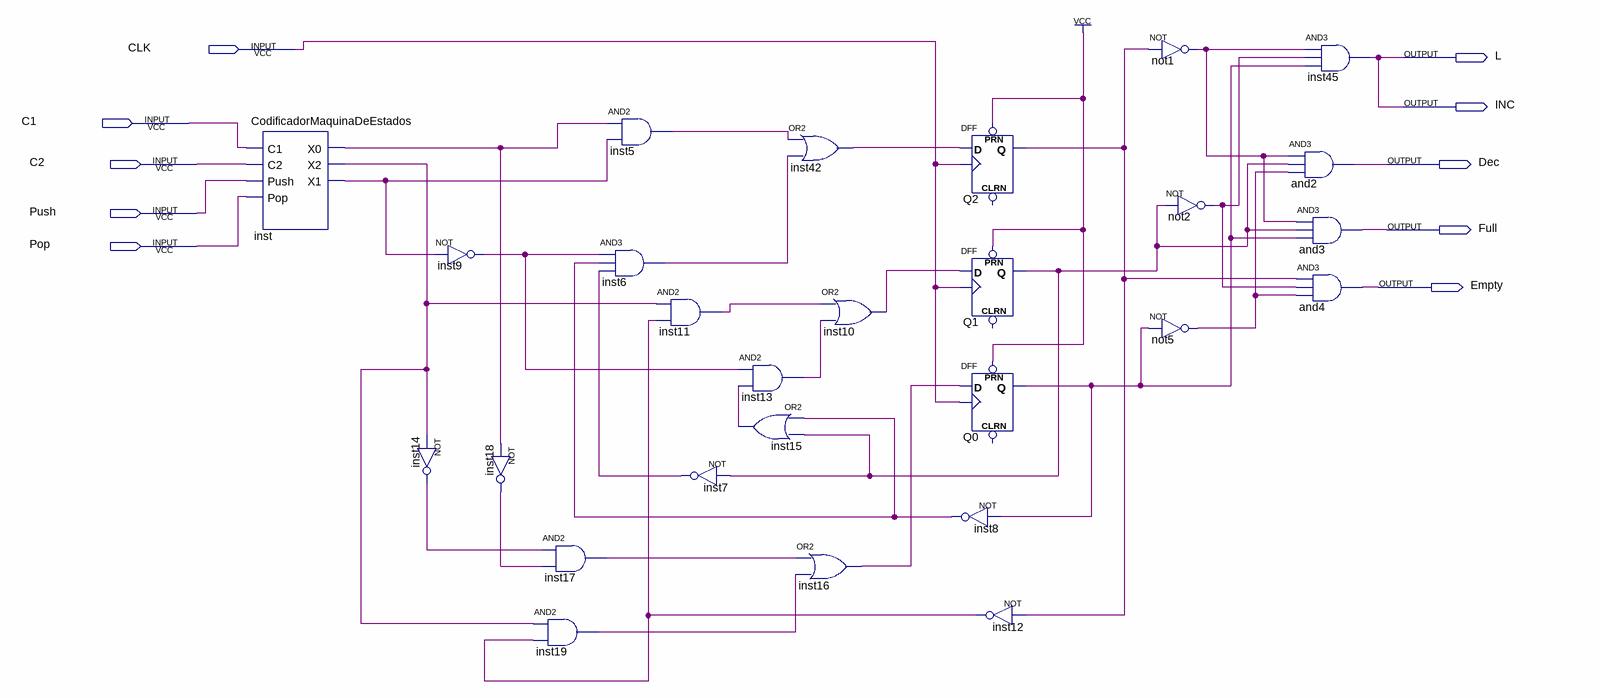
[diagram p0: schematic sheet]
// Quartus schematic MaquinaDestadosV1.bdf as structural Verilog: 27 symbols, 10 pins
module MaquinaDestadosV1 (
  input  CLK,
  input  C1,
  input  C2,
  input  Push,
  input  Pop,
  output L,
  output INC,
  output Dec,
  output Full,
  output Empty
);

  wire inst5_out, inst6_out, inst7_out, inst8_out, inst9_out, inst10_out, inst11_out, inst12_out, inst13_out,
       inst14_out, inst15_out, inst16_out, inst17_out, inst18_out, inst19_out, inst42_out, inst_x0, inst_x1,
       inst_x2, not1_out, not2_out, not5_out, Q0_q, Q1_q, Q2_q;

  CodificadorMaquinaDeEstados inst (.C1(C1), .C2(C2), .Push(Push), .Pop(Pop), .X0(inst_x0), .X2(inst_x2), .X1(inst_x1));
  not inst9 (inst9_out, inst_x1);
  not inst14 (inst14_out, inst_x2);
  not inst18 (inst18_out, inst_x0);
  and inst17 (inst17_out, inst14_out, inst18_out);
  and inst19 (inst19_out, inst_x2, inst12_out);
  and inst5 (inst5_out, inst_x0, inst_x1);
  and inst6 (inst6_out, inst9_out, inst8_out, inst7_out);
  and inst11 (inst11_out, inst_x2, inst12_out);
  not inst7 (inst7_out, Q1_q);
  and inst13 (inst13_out, inst9_out, inst15_out);
  or inst15 (inst15_out, inst8_out, Q1_q);
  or inst42 (inst42_out, inst5_out, inst6_out);
  or inst10 (inst10_out, inst11_out, inst13_out);
  or inst16 (inst16_out, inst17_out, inst19_out);
  DFF Q2 (.CLK(CLK), .D(inst42_out), .PRN(1'b1), .Q(Q2_q));  // open: CLRN
  DFF Q1 (.CLK(CLK), .D(inst10_out), .PRN(1'b1), .Q(Q1_q));  // open: CLRN
  DFF Q0 (.CLK(CLK), .D(inst16_out), .PRN(1'b1), .Q(Q0_q));  // open: CLRN
  not inst8 (inst8_out, Q0_q);
  not inst12 (inst12_out, Q2_q);
  not not1 (not1_out, Q2_q);
  not not2 (not2_out, Q1_q);
  not not5 (not5_out, Q0_q);
  and inst45 (INC, not1_out, not2_out, Q0_q);
  and and2 (Dec, not1_out, Q1_q, not5_out);
  and and3 (Full, not1_out, Q1_q, Q0_q);
  and and4 (Empty, Q2_q, not2_out, not5_out);

  assign L = INC;
endmodule
